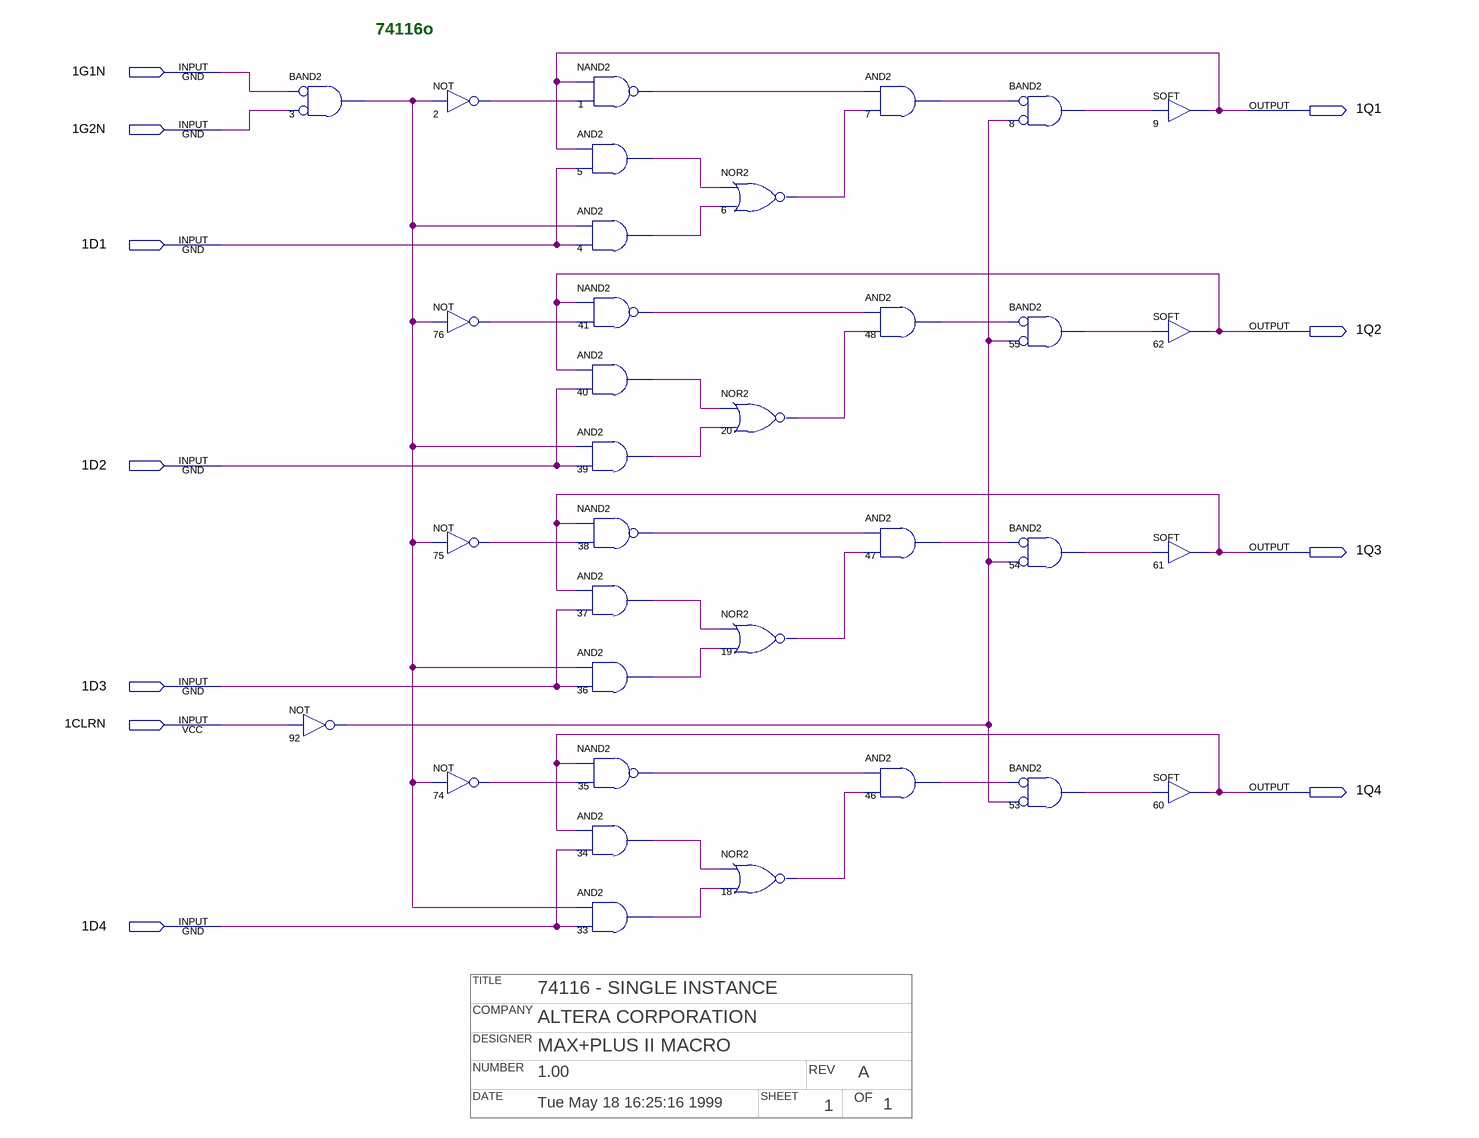
[diagram p0: schematic sheet]
// Quartus schematic 74116o.bdf as structural Verilog: 34 symbols, 11 pins
// Title block: TITLE: 74116 - SINGLE INSTANCE; COMPANY: ALTERA CORPORATION; DESIGNER: MAX+PLUS II MACRO; NUMBER: 1.00; REV: A; DATE: Tue May 18 16:25:16 1999; SHEET: 1; OF: 1
module \74116o  (
  input  \1G1N ,
  input  \1G2N ,
  input  \1D1 ,
  input  \1D2 ,
  input  \1D3 ,
  input  \1CLRN ,
  input  \1D4 ,
  output \1Q1 ,
  output \1Q2 ,
  output \1Q3 ,
  output \1Q4 
);

  wire n1_out, n2_out, n3_out, n4_out, n5_out, n6_out, n7_out, n8_out, n18_out, n19_out, n20_out, n33_out,
       n34_out, n35_out, n36_out, n37_out, n38_out, n39_out, n40_out, n41_out, n46_out, n47_out, n48_out,
       n53_out, n54_out, n55_out, n74_out, n75_out, n76_out, n92_out;

  and u_3 (n3_out, ~\1G1N , ~\1G2N );  // BAND2
  not u_92 (n92_out, \1CLRN );
  not u_2 (n2_out, n3_out);
  not u_76 (n76_out, n3_out);
  not u_75 (n75_out, n3_out);
  not u_74 (n74_out, n3_out);
  nand u_1 (n1_out, \1Q1 , n2_out);
  and u_5 (n5_out, \1Q1 , \1D1 );
  and u_4 (n4_out, n3_out, \1D1 );
  nand u_41 (n41_out, \1Q2 , n76_out);
  and u_40 (n40_out, \1Q2 , \1D2 );
  and u_39 (n39_out, n3_out, \1D2 );
  nand u_38 (n38_out, \1Q3 , n75_out);
  and u_37 (n37_out, \1Q3 , \1D3 );
  and u_36 (n36_out, n3_out, \1D3 );
  nand u_35 (n35_out, \1Q4 , n74_out);
  and u_34 (n34_out, \1Q4 , \1D4 );
  and u_33 (n33_out, n3_out, \1D4 );
  nor u_6 (n6_out, n5_out, n4_out);
  nor u_20 (n20_out, n40_out, n39_out);
  nor u_19 (n19_out, n37_out, n36_out);
  nor u_18 (n18_out, n34_out, n33_out);
  and u_7 (n7_out, n1_out, n6_out);
  and u_48 (n48_out, n41_out, n20_out);
  and u_47 (n47_out, n38_out, n19_out);
  and u_46 (n46_out, n35_out, n18_out);
  and u_8 (n8_out, ~n7_out, ~n92_out);  // BAND2
  and u_55 (n55_out, ~n48_out, ~n92_out);  // BAND2
  and u_54 (n54_out, ~n47_out, ~n92_out);  // BAND2
  and u_53 (n53_out, ~n46_out, ~n92_out);  // BAND2
  SOFT u_9 (.IN(n8_out), .OUT(\1Q1 ));
  SOFT u_62 (.IN(n55_out), .OUT(\1Q2 ));
  SOFT u_61 (.IN(n54_out), .OUT(\1Q3 ));
  SOFT u_60 (.IN(n53_out), .OUT(\1Q4 ));

  // Notes on the sheet:
  //   74116o
endmodule
